# Altium schematic sheet ECG_Chip.SchDoc
size A4; Organization: Altium Limited; Address1: 3 Minna Close; Address2: Belrose; Address3: NSW 2085; Address4: Australia
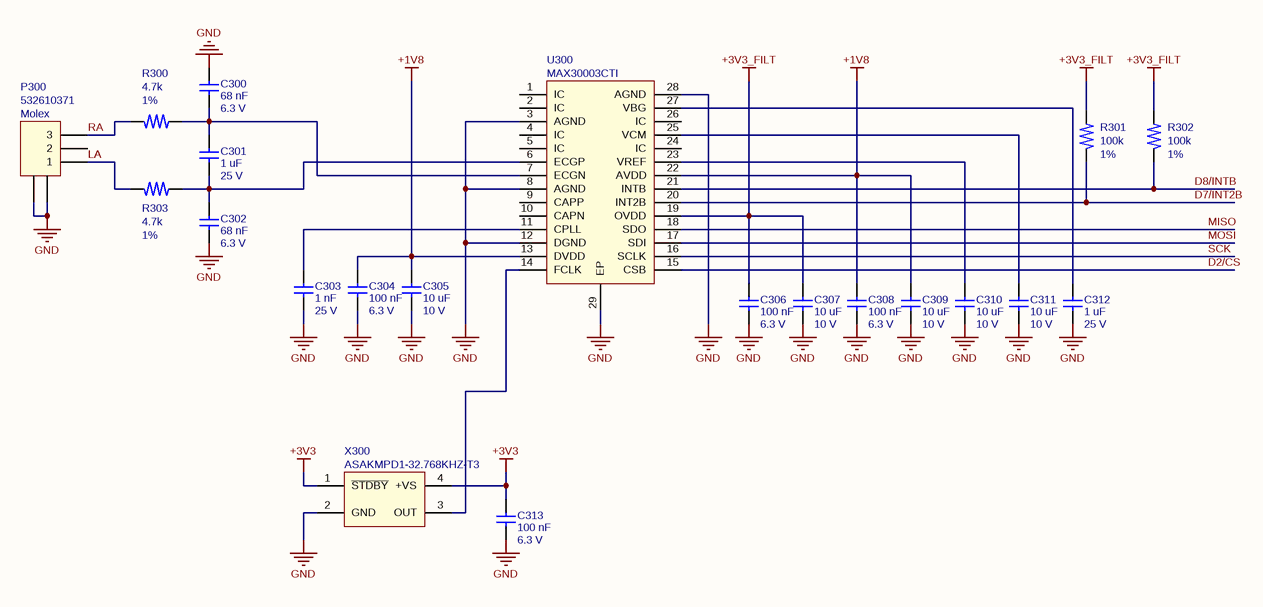
[diagram p0: ECG_Chip.SchDoc]

## Parts
C300  value 68 nF  Voltage Max: 6.3 V  [C0201]  (hidden comment: Capacitor no polarized)
C301  value 1 uF  Voltage Max: 25 V  [C0201]  (hidden comment: Capacitor no polarized)
C302  value 68 nF  Voltage Max: 6.3 V  [C0201]  (hidden comment: Capacitor no polarized)
C303  value 1 nF  Voltage Max: 25 V  [C0201]  (hidden comment: Capacitor no polarized)
C304  value 100 nF  Voltage Max: 6.3 V  [C0201]  (hidden comment: Capacitor no polarized)
C305  value 10 uF  Voltage Max: 10 V  [C0402]  (hidden comment: Capacitor no polarized)
C306  value 100 nF  Voltage Max: 6.3 V  [C0201]  (hidden comment: Capacitor no polarized)
C307  value 10 uF  Voltage Max: 10 V  [C0402]  (hidden comment: Capacitor no polarized)
C308  value 100 nF  Voltage Max: 6.3 V  [C0201]  (hidden comment: Capacitor no polarized)
C309  value 10 uF  Voltage Max: 10 V  [C0402]  (hidden comment: Capacitor no polarized)
C310  value 10 uF  Voltage Max: 10 V  [C0402]  (hidden comment: Capacitor no polarized)
C311  value 10 uF  Voltage Max: 10 V  [C0402]  (hidden comment: Capacitor no polarized)
C312  value 1 uF  Voltage Max: 25 V  [C0603]  (hidden comment: Capacitor no polarized)
C313  value 100 nF  Voltage Max: 6.3 V  [C0201]  (hidden comment: Capacitor no polarized)
P300  Manufacturer: Molex  [532610371]  (hidden comment: 532610471)
R300  value 4.7k  Tolerance: 1%  [R0201]  (hidden comment: R)
R301  value 100k  Tolerance: 1%  [R0201]  (hidden comment: R)
R302  value 100k  Tolerance: 1%  [R0201]  (hidden comment: R)
R303  value 4.7k  Tolerance: 1%  [R0201]  (hidden comment: R)
U300  AD8629ARMZ  [TQFN-28_5_5]  (value not drawn)
X300  Reference: ASAKMPD1-32.768KHZ-T3  [XTAL-16_12]  (hidden comment: LFSPXO071945Cutt)

## Nets
+1V8: C304.2 C305.2 C308.2 C309.2 U300.13(DVDD) U300.22(AVDD)
+3V3: C313.2 X300.1(~{STDBY}) X300.4(+VS)
+3V3_FILT: C306.2 C307.2 R301.1 R302.1 U300.19(OVDD)
GND: C300.1 C302.2 C303.2 C304.1 C305.1 C306.1 C307.1 C308.1 C309.1 C310.1 C311.1 C312.2 C313.1 P300.0 U300.3(AGND) U300.8(AGND) U300.12(DGND) U300.28(AGND) U300.29(EP) X300.2(GND)
D2/CS: U300.15(CSB)
D7/INT2B: R301.2 U300.20(INT2B)
D8/INTB: R302.2 U300.21(INTB)
LA: P300.1 R303.2
MISO: U300.18(SDO)
MOSI: U300.17(SDI)
RA: P300.3 R300.2
SCK: U300.16(SCLK)
NetC300_2: C300.2 C301.1 R300.1 U300.7(ECGN)
NetC301_2: C301.2 C302.1 R303.1 U300.6(ECGP)
NetC303_1: C303.1 U300.11(CPLL)
NetC310_2: C310.2 U300.23(VREF)
NetC311_2: C311.2 U300.25(VCM)
NetC312_1: C312.1 U300.27(VBG)
NetU300_14: U300.14(FCLK) X300.3(OUT)

Not connected (* = marked no-connect by the designer): P300 2; U300 1(IC) 2(IC) 4(IC) 5(IC) 9(CAPP) 10(CAPN) 24(IC) 26(IC)

## Notes on the sheet
- Title
- Size:
- Date:
- A4
- Number:
- Time:
- Revision:
- Sheet
- of
- File:

## Library data of the parts
C300 C302 = Capacitor no polarized: Generic Capacitor; Manufacturer: TDK; Dielectric: X5R; Tolerance: 10%; Reference: GRM033R60J683KE19D; Current Max: *; Package: 0201; Package Description: *; Power Max: *; Supplier 1: Mouser; Supplier 2: Farnell; Supplier 3: Digikey; Supplier 1 Part Number: 81-GRM033R60J683KE9D; Supplier 2 Part Number: 2999215; Supplier 3 Part Number: 490-3171-1-ND; ESR: *; Voltage Min: *; Voltage Typ: *
C301 C312 = Capacitor no polarized: Generic Capacitor; Manufacturer: Murata; Dielectric: X5R; Tolerance: 10%; Reference: GRM155R61E105KA12D; Current Max: *; Package: 0402; Package Description: *; Power Max: *; Supplier 1: Mouser; Supplier 2: Farnell; Supplier 3: Digikey; Supplier 1 Part Number: 81-GRM155R61E105KA12J; Supplier 2 Part Number: 2218855; Supplier 3 Part Number: 490-10017-1-ND; ESR: *; Voltage Min: *; Voltage Typ: *
C303 = Capacitor no polarized: Generic Capacitor; Manufacturer: Murata; Dielectric: X7R; Tolerance: 10%; Reference: GRM033R71E102KA01D; Current Max: *; Package: 0201; Package Description: *; Power Max: *; Supplier 1: Mouser; Supplier 2: Farnell; Supplier 3: Digikey; Supplier 1 Part Number: 81-GRM033R71E102KA1D; Supplier 2 Part Number: 1776006; Supplier 3 Part Number: 490-3184-1-ND; ESR: *; Voltage Min: *; Voltage Typ: *
C304 C306 C308 C313 = Capacitor no polarized: Generic Capacitor; Manufacturer: Murata; Dielectric: X5R; Tolerance: 10%; Reference: GMD033R60J104KE11D; Component URL: https://product.tdk.com/en/search/capacitor/ceramic/mlcc/info?part_no=C1608X5R0J156M080AC; Current Max: *; Package: 0201; Package Description: *; Power Max: *; Supplier 1: Mouser; Supplier 2: Farnell; Supplier 3: Digikey; Supplier 1 Part Number: 81-GMD033R60J104KE1D; Supplier 2 Part Number: 1657913; Supplier 3 Part Number: 490-14513-1-ND; ESR: *; Voltage Min: *; Voltage Typ: *
C305 C307 C309-C311 = Capacitor no polarized: Generic Capacitor; Manufacturer: AVX; Dielectric: X5R; Tolerance: 20%; Reference: 0402ZD106MAT2A; Component URL: https://product.tdk.com/en/search/capacitor/ceramic/mlcc/info?part_no=C1608X5R0J156M080AC; Current Max: *; Package: 0402; Package Description: *; Power Max: *; Supplier 1: Mouser; Supplier 2: Farnell; Supplier 3: Digikey; Supplier 1 Part Number: 581-0402ZD106MAT2A; Supplier 2 Part Number: 3340826; Supplier 3 Part Number: 478-10052-1-ND; ESR: *; Voltage Min: *; Voltage Typ: *
P300 = 532610371: 1.25mm Pitch, PicoBlade PCB Header, Single Row, Right-Angle, Surface Mount, Tin (Sn) Plating, Friction Lock, 3 Circuits, Tape and Reel; Voltage Max: 125 V; Component URL: https://www.molex.com/molex/products/part-detail/pcb_headers/0532610371; Footprint: *; Footprint Description: *; Power Max: *; Supplier 1: Mouser; Supplier 2: Farnell; Supplier 3: Digikey; Supplier 1 Part Number: 538-53261-0371; Supplier 2 Part Number: 1125359; Supplier 3 Part Number: WM7621CT-ND; Tolerance: *; Value: *; Voltage Min: *; Voltage Typ: *; Reference: 532610371; ESR: *; Current Max: *
R300 R303 = R: Generic Resistor; Manufacturer: VISHAY/DALE; Power Max: 0.050 W; Reference: CRCW02014K70FKED; Voltage Max: 30 V; Component URL: *; Current Max: *; Dielectric: *; Package: 0201; Package Description: *; Supplier 1: Mouser; Supplier 2: Farnell; Supplier 3: Digikey; Supplier 1 Part Number: 791-WR04X4701FTL; Supplier 2 Part Number: 2906613; Supplier 3 Part Number: 541-4.70KAABCT-ND; Voltage Min: *; Voltage Typ: *; ESR: *
R301 R302 = R: Generic Resistor; Manufacturer: VISHAY/DALE; Power Max: 0.0050 W; Reference: CRCW0201100KFKED; Voltage Max: 30 V; Component URL: *; Current Max: *; Dielectric: *; Package: 0201; Package Description: *; Supplier 1: Mouser; Supplier 2: Farnell; Supplier 3: Digikey; Supplier 1 Part Number: 71-CRCW0201100KFKED; Supplier 2 Part Number: 2616720; Supplier 3 Part Number: 541-100KAABCT-ND; Voltage Min: *; Voltage Typ: *; ESR: *
U300 = MAX30003CTI: Ultra-Low Power, Single-Channel Integrated  Biopotential (ECG, R-to-R Detection) AFE; Manufacturer: Maxim Integrated; Voltage Max: 3.6 V; Component URL: *; Supplier 1: Mouser; Supplier 2: Farnell; Supplier 3: Digikey; Supplier 1 Part Number: 700-MAX30003CTI+; Supplier 2 Part Number: 2668156; Supplier 3 Part Number: MAX30003CTI+TCT-ND; Tolerance: *; Value: *; Voltage Min: *; Voltage Typ: *; Power Max: *; ESR: *; Reference: MAX30003CTI; Current Max: *; Footprint: *; Footprint Description: *
X300 = LFSPXO071945Cutt: Crystal clock oscillator; Manufacturer: Abracon; Current Max: 0.025 A; Voltage Max: 3.6 V; Voltage Min: 3.0 V; Voltage Typ: 1.6 V; Component URL: *; ESR: *; Power Max: *; Supplier 1: Mouser; Supplier 2: Farnell; Supplier 3: Digikey; Supplier 1 Part Number: 815-ASAKMPD1-32.768T; Supplier 2 Part Number: 2920073; Supplier 3 Part Number: 535-14677-1-ND; Tolerance: *; Value: *; Footprint: *; Footrprint Description: *